# EAGLE design UVandLight(I2C_V1) (EAGLE 6.5.0)
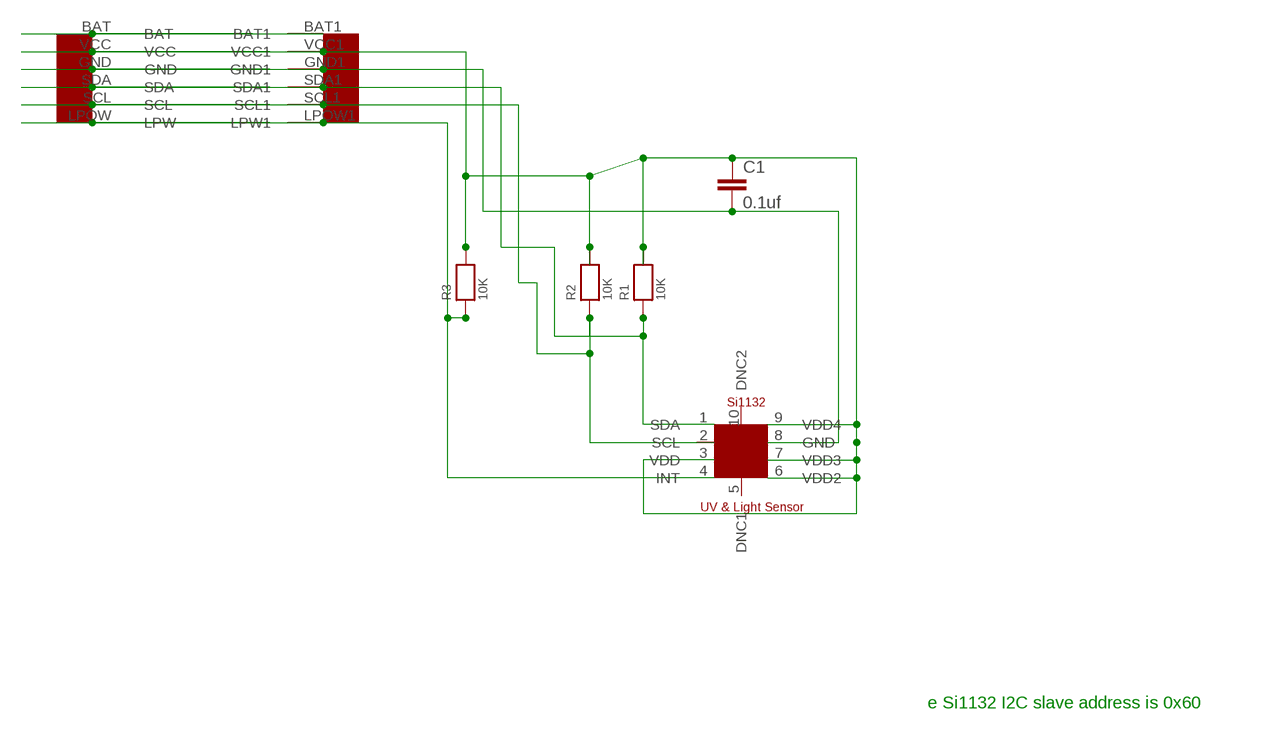
[diagram p0: schematic, sheet 1]

## Parts
C1  0.1uf  CAP0402-CAP  [0402-CAP]
R1  10K  RESISTOR0402  [0402]
R2  10K  RESISTOR0402  [0402]
R3  10K  RESISTOR0402  [0402]
U$1  EASYI2C6PINHEADER  [EASYI2C6PINHEADER]
U$2  UV-SI1132  [UV-SI1132]

## Nets
GND: C1.2 U$1.GND U$1.GND1 U$2.8(GND)
N$2: R1.1 U$1.SDA U$1.SDA1 U$2.1(SDA)
N$3: R3.1 U$1.LPOW1(LPW1) U$1.LPOW(LPW) U$2.4(INT)
N$4: U$1.BAT U$1.BAT1
N$13: C1.1 R1.2 R2.2 R3.2 U$1.VCC U$1.VCC1 U$2.3(VDD) U$2.6(VDD2) U$2.7(VDD3) U$2.9(VDD4)
N$17: R2.1 U$1.SCL U$1.SCL1 U$2.2(SCL)
Unconnected: U$2.5(DNC1) U$2.10(DNC2)

## Notes on the sheet
- e Si1132 I2C slave address is 0x60

## Library data of the parts
C1 = SparkFun-Capacitors:CAP: Capacitor Standard 0603 ceramic capacitor, and 0.1" leaded capacitor.
R1-R3 = microbuilder:RESISTOR: Resistors 0402 - 0402 Surface Mount Package 22 Ohm 1% 1/16W [Digikey: 311-22.0LRTR-ND] 33 Ohm 5% 1/16W 1.0K 5% 1/16W 1.5K 5% 1/16W 2.0K 1% 1/16W 10.0K 1% 1/16W [Digikey: 311-10.0KLRTR-ND] 10.0K 5% 1/16W [Digikey: RMCF0402JT10K0TR-ND] 12.1K 1% 1/16W [Digikey: 311-22.0LRTR-ND] 100.0K 5% 1/16W 0603 - 0603 Surface Mount Package 0 Ohm 1/10 Watt 1% Resistor 15 Ohm 1/10 Watt 1% Resistor 33 Ohm 1/10 Watt 1% Resistor 49.9 Ohm 1/10 Watt 1% Resistor 100 Ohm 1/10 Watt 1% Resistor 150 Ohm 1/10 Watt 1% Resistor 240 Ohm 1/10 Watt 1% Resistor 390 Ohm 1/10 Watt 1% Resistor 560 Ohm 1/10 Watt 1% Resistor 680 Ohm 1/10 Watt 1% Resistor 750 Ohm 1/10 Watt 1% Resistor 1.0K Ohm 1/10 Watt 1% Resistor 1.5K Ohm 1/10 Watt 1% Resistor 2.0K Ohm 1/10 Watt 1% Resistor 2.2K Ohm 1/10 Watt 1% Resistor 3.3K Ohm 1/10 Watt 1% Resistor 4.7K Ohm 1/10 Watt 1% Resistor 10.0K Ohm 1/10 Watt 1% Resistor 12.0K Ohm 1/10 Watt 1% Resistor 12.1K Ohm 1/10 Watt 1% Resistor 20.0K Ohm 1/10 Watt 1% Resistor 33.0K Ohm 1/10 Watt 1% Resistor 100.0K Ohm 1/10 Watt 1% Resistor 0805 - 0805 Surface Mount Package 0 Ohm 1/8 Watt 1% Resistor 33 Ohm 1/8 Watt 1% Resistor 100 Ohm 1/8 Watt 1% Resistor 150 Ohm 1/8 Watt 1% Resistor 200 Ohm 1/8 Watt 1% Resistor 240 Ohm 1/8 Watt 1% Resistor 330 Ohm 1/8 Watt 1% Resistor 390 Ohm 1/8 Watt 1% Resistor 470 Ohm 1/8 Watt 1% Resistor 1.0K Ohm 1/8 Watt 1% Resistor 1.5K Ohm 1/8 Watt 1% Resistor 2.0K Ohm 1/8 Watt 1% Resistor 4.7K Ohm 1/8 Watt 1% Resistor 5.1K Ohm 1/8 Watt 1% Resistor 5.6K Ohm 1/8 Watt 1% Resistor 10.0K Ohm 1/8 Watt 1% Resistor 22.0K Ohm 1/8 Watt 1% Resistor 33.0K Ohm 1/8 Watt 1% Resistor 100K Ohm 1/8 Watt 1% Resistor 1206 - 1206 Surface Mount Package 2012 - 2010 Surface Mount Package 0.11 Ohm 1/2 Watt 1% Resistor - Digikey: RHM.11UCT-ND
U$1 = UniqueInteractionsLib:EASYI2C6PINHEADER
U$2 = UniqueInteractionsLib:UV-SI1132: UV and Light Sensor Si1132 Order from Mouser 1: £1.11 25: £1.08 100: £1.04 http://uk.mouser.com/ProductDetail/Silicon-Labs/Si1132-A10-GMR/?qs=sGAEpiMZZMsrChSOYEGTCQcGlzpp%252bxLilVzr3TdZGsg%3d

## Board
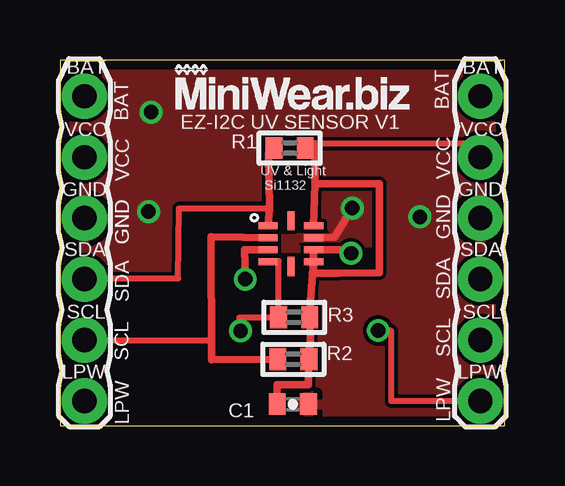
[diagram p1: board, top side]
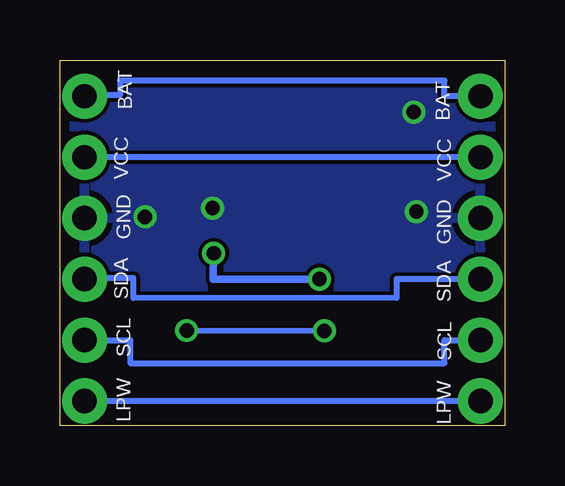
[diagram p2: board, bottom side, seen from below]

Size 18.55 x 15.23 mm. Coordinates in mm from the lower left corner, seen from the top.
Outline: 0,0 18.55,0 18.55,15.22 0,15.23 0,0
Copper layers (1*16): Top 0.0356mm / dielectric 1.5011mm / Bottom 0.0356mm
Design rules "oshParkPCBDesignRules": minimum track width 6mil, minimum drill 13mil, track to track 6mil, track to pad 6mil, pad to pad 6mil, via to via 6mil, smd to smd 6mil, copper to edge 15mil, drill to drill 6mil, minimum pad ring 7mil, minimum via ring 7mil, stop-mask expansion 3mil, vias tented up to drill 0mil, thermal gap 10mil

### Footprints (pad centres in the part's own frame; a part is rotated, then mirrored left to right if it is on the bottom)
0402-CAP = smd 0.7 x 0.9: 1 -0.65,0; 2 0.65,0
0402 = smd 0.7 x 0.9: 1 -0.65,0; 2 0.65,0
EASYI2C6PINHEADER = drill 1.016 pad 1.88: BAT 2.54,13.97; BAT1 19.05,13.97; GND 2.54,8.89; GND1 19.05,8.89; LPOW 2.54,1.27; LPOW1 19.05,1.27; SCL 2.54,3.81; SCL1 19.05,3.81; SDA 2.54,6.35; SDA1 19.05,6.35; VCC 2.54,11.43; VCC1 19.05,11.43
UV-SI1132 = smd 0.8 x 0.3: 1 -0.95,1.7; 2 -0.95,1.2; 3 -0.95,0.7; 4 -0.95,0.2; 6 0.95,0.2; 7 0.95,0.7; 8 0.95,1.2; 9 0.95,1.7 | smd 0.3 x 0.8: 5 0,0; 10 0,1.9

### Placement (x,y rotation side)
C1  9.71,0.89 0 top
R1  9.58,11.56 0 top
R2  9.73,2.76 0 top
R3  9.77,4.51 0 top
U$1  -1.52,-0.25 0 top
U$2  9.63,6.63 0 top
U$3  [LOGO2]  4.7,12.98 0 top

### Tracks (layer width: path | path; a pad name or v marks a point on that pad's centre or on a via)
GND  (via drill 0.6)
  Top 0.305: U$2.8 11.45,7.84 v12.19,9.06
  other vias: 3.69,8.91 15.01,8.69 3.8,13.06
  pour Bottom: -0.4,15.55 18.65,15.55 18.57,0.1 -0.48,0.1
  pour Top: -0.52,0.06 -0.36,15.54 18.69,15.54 18.53,0.06
N$2
  Top 0.254: 8.73,9.05 4.96,9.05 4.93,6.12 0.99,6.12 U$1.SDA
  Top 0.305: R1.1 8.7,11.33 8.73,9.05 U$2.1
  Bottom 0.254: U$1.SDA 4.52,6.1 4.52,5.31 15.49,5.32 15.49,6.14 17.53,6.14 U$1.SDA1
N$3  (via drill 0.6)
  Top 0.254: U$2.4 9.12,6.85 R3.1 7.48,4.51 v7.53,3.94 | v13.27,3.96 13.82,3.94 13.82,1.02 U$1.LPOW1
  Bottom 0.254: v13.27,3.96 v7.53,3.94 | U$1.LPOW U$1.LPOW1
N$4
  Bottom 0.254: U$1.BAT 2.52,13.72 2.52,14.37 16.05,14.37 16.05,13.77 17.53,13.77 U$1.BAT1
N$13  (via drill 0.6)
  Top 0.254: 10.63,11.75 17.52,11.75 U$1.VCC1
  Top 0.305: U$2.6 10.41,4.62 | 10.41,4.62 R3.2 | 10.41,4.62 10.44,3.58 R2.2 10.39,3.25 10.36,1.7 9.05,1.7 C1.1 | R1.2 10.45,11.71 10.63,11.75 10.63,10.07 | 10.63,10.07 U$2.9 | 10.63,10.07 13.32,10.07 13.32,6.37 11.63,6.34 10.58,6.34 U$2.6 | U$2.6 U$2.7 12.11,7.33 v12.14,7.18 | v7.73,6.1 7.69,7.33 U$2.3
  Bottom 0.254: U$1.VCC U$1.VCC1
  Bottom 0.305: v12.14,7.18 12.16,6.1 v7.73,6.1
N$17
  Top 0.254: 6.32,3.91 6.32,3.56 | 6.32,3.56 6.32,2.75 | U$1.SCL 6.32,3.56
  Top 0.305: R2.1 6.32,2.75 6.3,7.86 7.61,7.84 U$2.2
  Bottom 0.254: U$1.SCL1 15.62,3.56 15.62,2.6 2.52,2.6 2.52,3.56 U$1.SCL

### Text on the board
tNames: EZ-I2C UV SENSOR V1